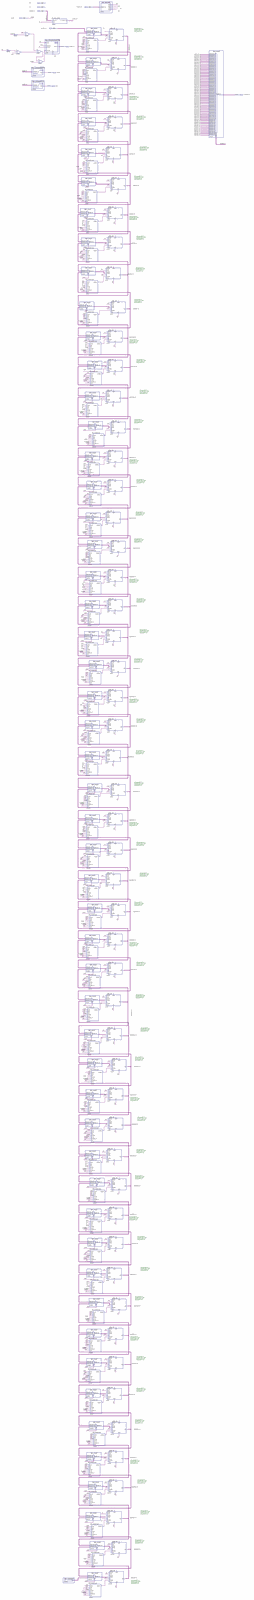
[diagram p0: schematic sheet, whole]
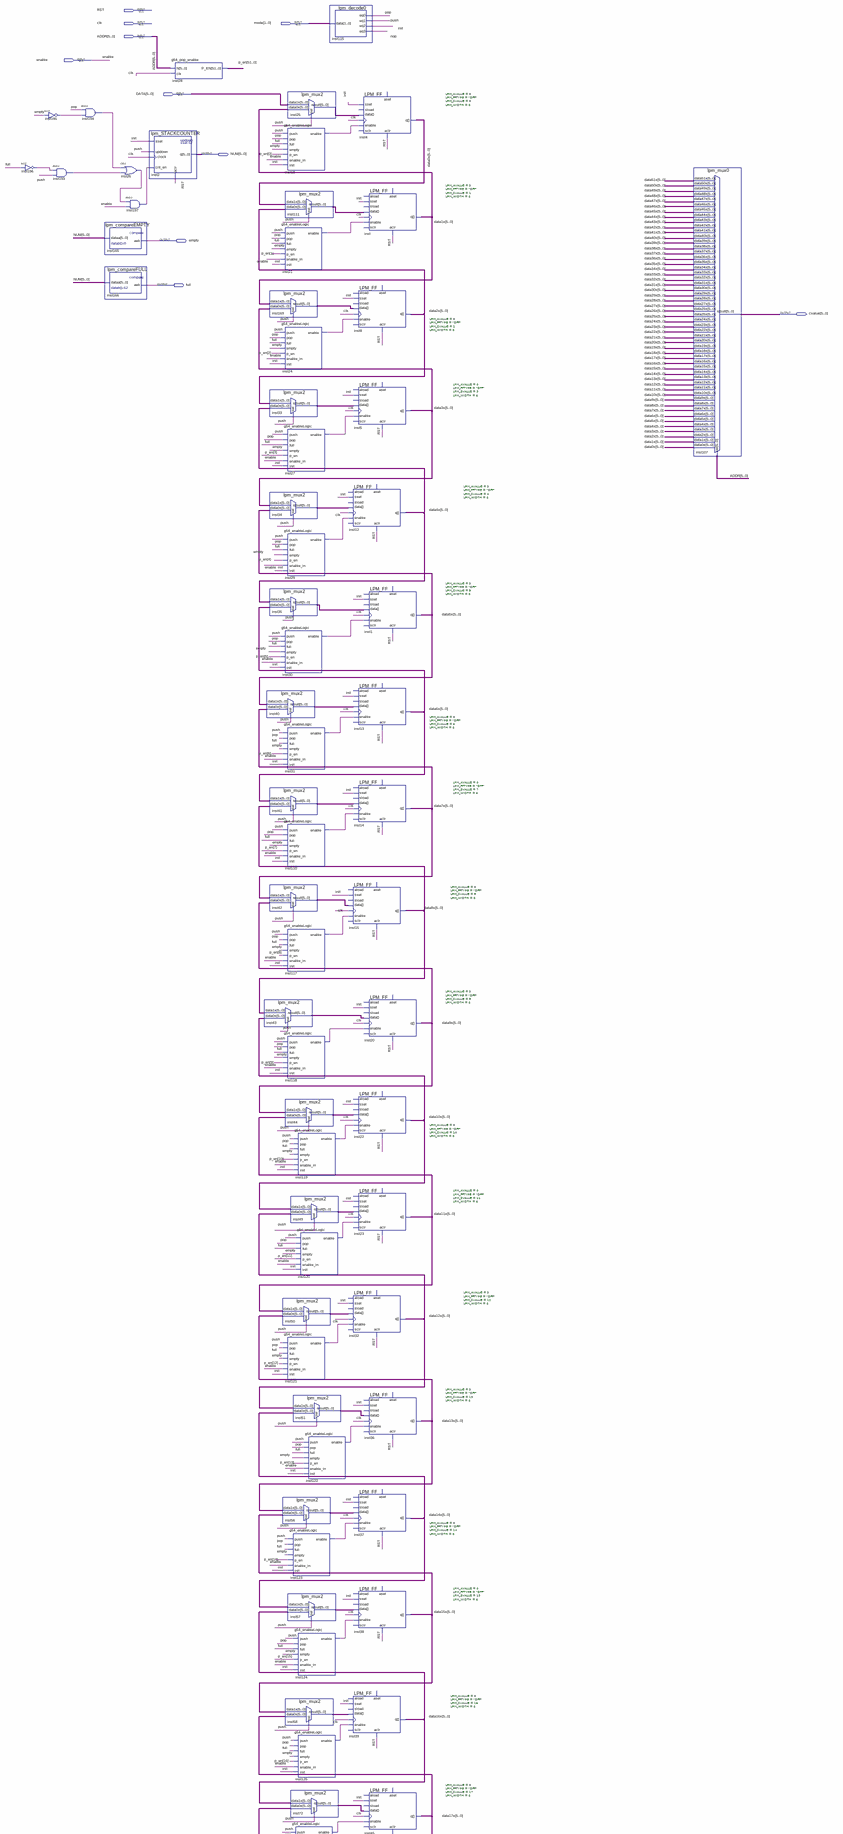
[diagram p1: schematic sheet, upper part]
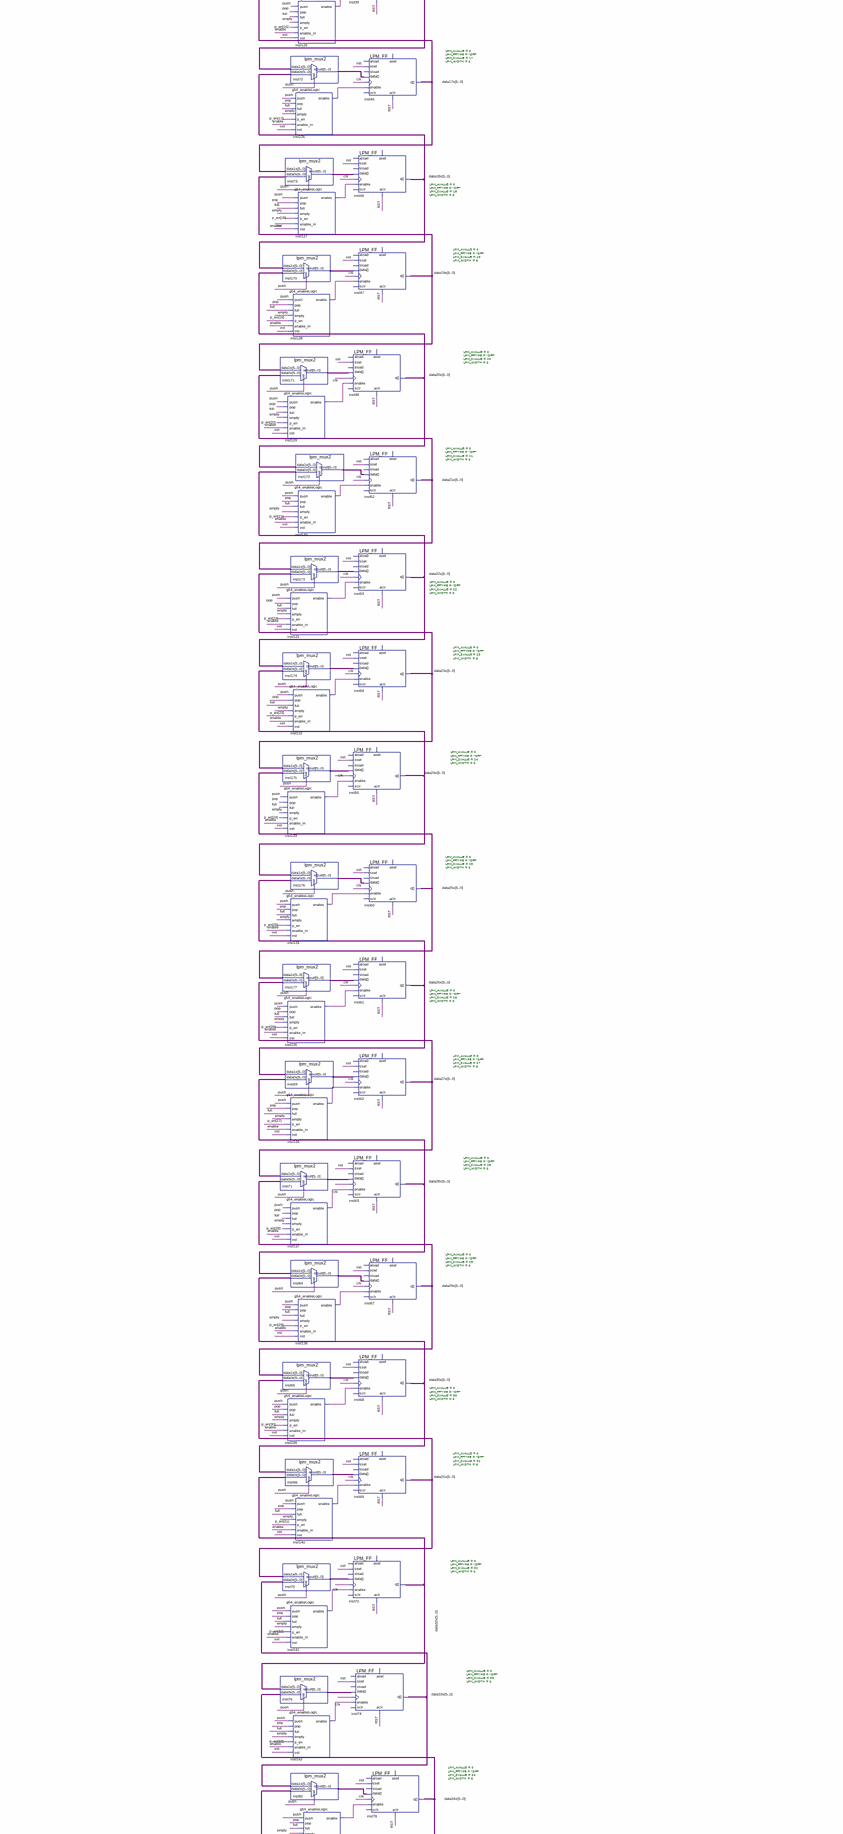
[diagram p2: schematic sheet, middle part]
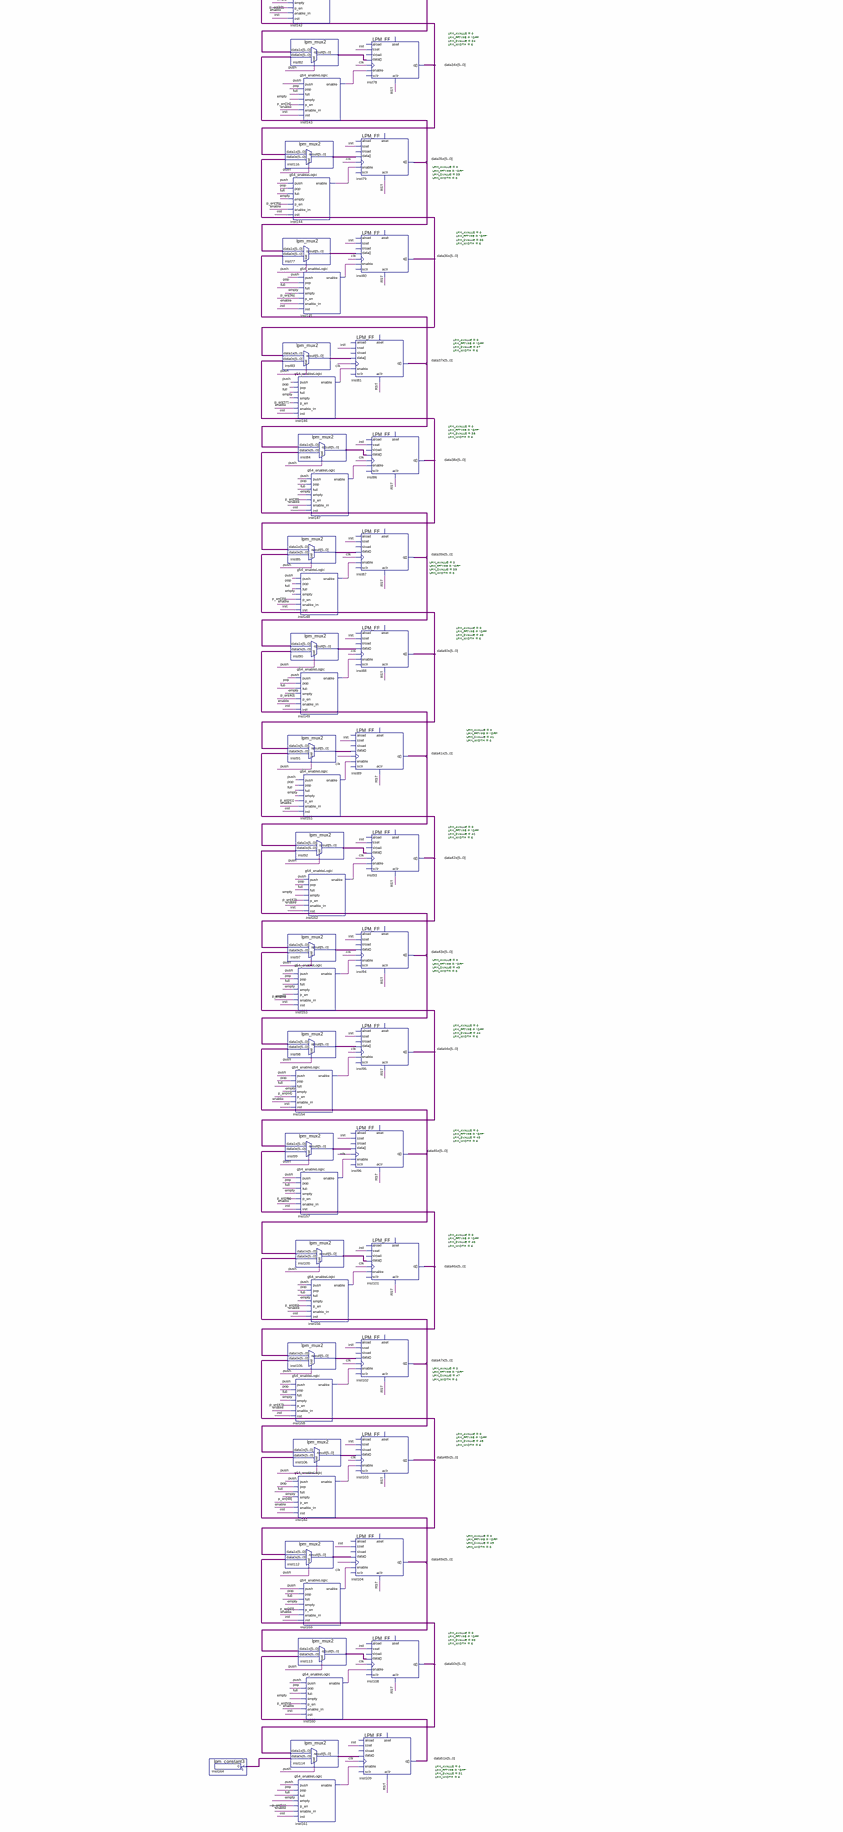
[diagram p3: schematic sheet, lower part]
// Quartus schematic g54_stack52.bdf as structural Verilog: 169 symbols, 10 pins
module g54_stack52 (
  input  RST,
  input  clk,
  input  [1:0] mode,
  input  [5:0] ADDR,
  input  enable,
  input  [5:0] DATA,
  output [5:0] NUM,
  output empty,
  output full,
  output [5:0] cvalue
);

  wire init, inst18_enable, inst21_enable, inst24_enable, inst26_out, inst27_enable, inst29_enable,
       inst30_enable, inst31_enable, inst110_enable, inst117_enable, inst118_enable, inst119_enable,
       inst120_enable, inst121_enable, inst122_enable, inst123_enable, inst124_enable, inst125_enable,
       inst126_enable, inst127_enable, inst128_enable, inst129_enable, inst130_enable, inst131_enable,
       inst132_enable, inst133_enable, inst134_enable, inst135_enable, inst136_enable, inst137_enable,
       inst138_enable, inst139_enable, inst140_enable, inst141_enable, inst142_enable, inst143_enable,
       inst144_enable, inst145_enable, inst146_enable, inst147_enable, inst148_enable, inst149_enable,
       inst151_enable, inst152_enable, inst153_enable, inst154_enable, inst156_enable, inst157_enable,
       inst158_enable, inst159_enable, inst160_enable, inst161_enable, inst162_enable, inst193_out,
       inst194_out, inst195_out, inst196_out, inst197_out, nop, pop, push;
  wire [5:0] data0x, data1x, data2x, data3x, data4x, data5x, data6x, data7x, data8x, data9x, data10x,
       data11x, data12x, data13x, data14x, data15x, data16x, data17x, data18x, data19x, data20x, data21x,
       data22x, data23x, data24x, data25x, data26x, data27x, data28x, data29x, data30x, data31x, data32x,
       data33x, data34x, data35x, data36x, data37x, data38x, data39x, data40x, data41x, data42x, data43x,
       data44x, data45x, data46x, data47x, data48x, data49x, data50x, data51x, inst25_result, inst33_result,
       inst34_result, inst35_result, inst40_result, inst41_result, inst42_result, inst43_result,
       inst44_result, inst49_result, inst50_result, inst51_result, inst56_result, inst57_result,
       inst58_result, inst59_result, inst64_result, inst65_result, inst66_result, inst71_result,
       inst72_result, inst73_result, inst75_result, inst76_result, inst77_result, inst82_result,
       inst83_result, inst84_result, inst85_result, inst90_result, inst91_result, inst92_result,
       inst97_result, inst98_result, inst99_result, inst100_result, inst105_result, inst106_result,
       inst111_result, inst112_result, inst113_result, inst114_result, inst116_result, inst164_result,
       inst169_result, inst170_result, inst171_result, inst172_result, inst173_result, inst174_result,
       inst175_result, inst176_result, inst177_result;
  wire [51:0] p_en;

  not inst196 (inst196_out, full);
  not inst195 (inst195_out, empty);
  and inst193 (inst193_out, inst196_out, push);
  and inst194 (inst194_out, pop, inst195_out);
  lpm_compareEMPTY inst165 (.dataa(NUM), .aeb(empty));
  lpm_compareFULL inst166 (.dataa(NUM), .aeb(full));
  or inst26 (inst26_out, inst194_out, inst193_out);
  and inst197 (inst197_out, inst26_out, enable);
  lpm_STACKCOUNTER inst2 (.sset(init), .updown(push), .clock(clk), .cnt_en(inst197_out), .aclr(RST), .q(NUM));
  g54_pop_enable inst28 (.N(ADDR), .clk(clk), .P_EN(p_en));
  lpm_constant3 inst164 (.result(inst164_result));
  g54_enableLogic inst21 (
    .push(push), .pop(pop), .full(full), .empty(empty), .p_en(p_en[1]), .enable_in(enable), .init(init),
    .enable(inst21_enable));
  lpm_mux2 inst169 (.data1x(data1x), .data0x(data3x), .sel(push), .result(inst169_result));
  g54_enableLogic inst24 (
    .push(push), .pop(pop), .full(full), .empty(empty), .p_en(p_en[2]), .enable_in(enable), .init(init),
    .enable(inst24_enable));
  lpm_mux2 inst33 (.data1x(data2x), .data0x(data4x), .sel(push), .result(inst33_result));
  lpm_mux2 inst34 (.data1x(data3x), .data0x(data5x), .sel(push), .result(inst34_result));
  lpm_mux2 inst35 (.data1x(data4x), .data0x(data6x), .sel(push), .result(inst35_result));
  g54_enableLogic inst30 (
    .push(push), .pop(pop), .full(full), .empty(empty), .p_en(p_en[5]), .enable_in(enable), .init(init),
    .enable(inst30_enable));
  lpm_mux2 inst40 (.data1x(data5x), .data0x(data7x), .sel(push), .result(inst40_result));
  lpm_mux2 inst41 (.data1x(data6x), .data0x(data8x), .sel(push), .result(inst41_result));
  lpm_mux2 inst42 (.data1x(data7x), .data0x(data9x), .sel(push), .result(inst42_result));
  lpm_mux2 inst43 (.data1x(data8x), .data0x(data10x), .sel(push), .result(inst43_result));
  lpm_mux2 inst171 (.data1x(data19x), .data0x(data21x), .sel(push), .result(inst171_result));
  lpm_mux2 inst71 (.data1x(data27x), .data0x(data29x), .sel(push), .result(inst71_result));
  lpm_mux2 inst76 (.data1x(data32x), .data0x(data34x), .sel(push), .result(inst76_result));
  lpm_mux2 inst25 (.data1x(DATA), .data0x(data1x), .sel(push), .result(inst25_result));
  g54_enableLogic inst18 (
    .push(push), .pop(pop), .full(full), .empty(empty), .p_en(p_en[0]), .enable_in(enable), .init(init),
    .enable(inst18_enable));
  lpm_mux2 inst111 (.data1x(data0x), .data0x(data2x), .sel(push), .result(inst111_result));
  g54_enableLogic inst27 (
    .push(push), .pop(pop), .full(full), .empty(empty), .p_en(p_en[3]), .enable_in(enable), .init(init),
    .enable(inst27_enable));
  g54_enableLogic inst29 (
    .push(push), .pop(pop), .full(full), .empty(empty), .p_en(p_en[4]), .enable_in(enable), .init(init),
    .enable(inst29_enable));
  g54_enableLogic inst31 (
    .push(push), .pop(pop), .full(full), .empty(empty), .p_en(p_en[6]), .enable_in(enable), .init(init),
    .enable(inst31_enable));
  g54_enableLogic inst110 (
    .push(push), .pop(pop), .full(full), .empty(empty), .p_en(p_en[7]), .enable_in(enable), .init(init),
    .enable(inst110_enable));
  g54_enableLogic inst117 (
    .push(push), .pop(pop), .full(full), .empty(empty), .p_en(p_en[8]), .enable_in(enable), .init(init),
    .enable(inst117_enable));
  g54_enableLogic inst118 (
    .push(push), .pop(pop), .full(full), .empty(empty), .p_en(p_en[9]), .enable_in(enable), .init(init),
    .enable(inst118_enable));
  lpm_mux2 inst44 (.data1x(data9x), .data0x(data11x), .sel(push), .result(inst44_result));
  g54_enableLogic inst119 (
    .push(push), .pop(pop), .full(full), .empty(empty), .p_en(p_en[10]), .enable_in(enable), .init(init),
    .enable(inst119_enable));
  lpm_mux2 inst49 (.data1x(data10x), .data0x(data12x), .sel(push), .result(inst49_result));
  g54_enableLogic inst120 (
    .push(push), .pop(pop), .full(full), .empty(empty), .p_en(p_en[11]), .enable_in(enable), .init(init),
    .enable(inst120_enable));
  lpm_mux2 inst50 (.data1x(data11x), .data0x(data13x), .sel(push), .result(inst50_result));
  g54_enableLogic inst121 (
    .push(push), .pop(pop), .full(full), .empty(empty), .p_en(p_en[12]), .enable_in(enable), .init(init),
    .enable(inst121_enable));
  lpm_mux2 inst51 (.data1x(data12x), .data0x(data14x), .sel(push), .result(inst51_result));
  lpm_mux2 inst56 (.data1x(data13x), .data0x(data15x), .sel(push), .result(inst56_result));
  g54_enableLogic inst123 (
    .push(push), .pop(pop), .full(full), .empty(empty), .p_en(p_en[14]), .enable_in(enable), .init(init),
    .enable(inst123_enable));
  lpm_mux2 inst57 (.data1x(data14x), .data0x(data16x), .sel(push), .result(inst57_result));
  g54_enableLogic inst124 (
    .push(push), .pop(pop), .full(full), .empty(empty), .p_en(p_en[15]), .enable_in(enable), .init(init),
    .enable(inst124_enable));
  lpm_mux2 inst58 (.data1x(data15x), .data0x(data17x), .sel(push), .result(inst58_result));
  g54_enableLogic inst125 (
    .push(push), .pop(pop), .full(full), .empty(empty), .p_en(p_en[16]), .enable_in(enable), .init(init),
    .enable(inst125_enable));
  lpm_mux2 inst72 (.data1x(data16x), .data0x(data18x), .sel(push), .result(inst72_result));
  g54_enableLogic inst126 (
    .push(push), .pop(pop), .full(full), .empty(empty), .p_en(p_en[17]), .enable_in(enable), .init(init),
    .enable(inst126_enable));
  lpm_mux2 inst73 (.data1x(data17x), .data0x(data19x), .sel(push), .result(inst73_result));
  g54_enableLogic inst127 (
    .push(push), .pop(pop), .full(full), .empty(empty), .p_en(p_en[18]), .enable_in(enable), .init(init),
    .enable(inst127_enable));
  lpm_mux2 inst170 (.data1x(data18x), .data0x(data20x), .sel(push), .result(inst170_result));
  g54_enableLogic inst128 (
    .push(push), .pop(pop), .full(full), .empty(empty), .p_en(p_en[19]), .enable_in(enable), .init(init),
    .enable(inst128_enable));
  g54_enableLogic inst129 (
    .push(push), .pop(pop), .full(full), .empty(empty), .p_en(p_en[20]), .enable_in(enable), .init(init),
    .enable(inst129_enable));
  lpm_mux2 inst172 (.data1x(data20x), .data0x(data22x), .sel(push), .result(inst172_result));
  g54_enableLogic inst130 (
    .push(push), .pop(pop), .full(full), .empty(empty), .p_en(p_en[21]), .enable_in(enable), .init(init),
    .enable(inst130_enable));
  lpm_mux2 inst173 (.data1x(data21x), .data0x(data23x), .sel(push), .result(inst173_result));
  g54_enableLogic inst131 (
    .push(push), .pop(pop), .full(full), .empty(empty), .p_en(p_en[22]), .enable_in(enable), .init(init),
    .enable(inst131_enable));
  lpm_mux2 inst174 (.data1x(data22x), .data0x(data24x), .sel(push), .result(inst174_result));
  g54_enableLogic inst132 (
    .push(push), .pop(pop), .full(full), .empty(empty), .p_en(p_en[23]), .enable_in(enable), .init(init),
    .enable(inst132_enable));
  lpm_mux2 inst175 (.data1x(data23x), .data0x(data25x), .sel(push), .result(inst175_result));
  g54_enableLogic inst133 (
    .push(push), .pop(pop), .full(full), .empty(empty), .p_en(p_en[24]), .enable_in(enable), .init(init),
    .enable(inst133_enable));
  lpm_mux2 inst176 (.data1x(data24x), .data0x(data26x), .sel(push), .result(inst176_result));
  g54_enableLogic inst134 (
    .push(push), .pop(pop), .full(full), .empty(empty), .p_en(p_en[25]), .enable_in(enable), .init(init),
    .enable(inst134_enable));
  lpm_mux2 inst177 (.data1x(data25x), .data0x(data27x), .sel(push), .result(inst177_result));
  g54_enableLogic inst135 (
    .push(push), .pop(pop), .full(full), .empty(empty), .p_en(p_en[26]), .enable_in(enable), .init(init),
    .enable(inst135_enable));
  lpm_mux2 inst59 (.data1x(data26x), .data0x(data28x), .sel(push), .result(inst59_result));
  g54_enableLogic inst136 (
    .push(push), .pop(pop), .full(full), .empty(empty), .p_en(p_en[27]), .enable_in(enable), .init(init),
    .enable(inst136_enable));
  g54_enableLogic inst137 (
    .push(push), .pop(pop), .full(full), .empty(empty), .p_en(p_en[28]), .enable_in(enable), .init(init),
    .enable(inst137_enable));
  lpm_mux2 inst64 (.data1x(data28x), .data0x(data30x), .sel(push), .result(inst64_result));
  g54_enableLogic inst138 (
    .push(push), .pop(pop), .full(full), .empty(empty), .p_en(p_en[29]), .enable_in(enable), .init(init),
    .enable(inst138_enable));
  lpm_mux2 inst65 (.data1x(data29x), .data0x(data31x), .sel(push), .result(inst65_result));
  g54_enableLogic inst139 (
    .push(push), .pop(pop), .full(full), .empty(empty), .p_en(p_en[30]), .enable_in(enable), .init(init),
    .enable(inst139_enable));
  lpm_mux2 inst66 (.data1x(data30x), .data0x(data32x), .sel(push), .result(inst66_result));
  g54_enableLogic inst140 (
    .push(push), .pop(pop), .full(full), .empty(empty), .p_en(p_en[31]), .enable_in(enable), .init(init),
    .enable(inst140_enable));
  lpm_mux2 inst75 (.data1x(data31x), .data0x(data33x), .sel(push), .result(inst75_result));
  g54_enableLogic inst141 (
    .push(push), .pop(pop), .full(full), .empty(empty), .p_en(p_en[32]), .enable_in(enable), .init(init),
    .enable(inst141_enable));
  g54_enableLogic inst142 (
    .push(push), .pop(pop), .full(full), .empty(empty), .p_en(p_en[33]), .enable_in(enable), .init(init),
    .enable(inst142_enable));
  lpm_mux2 inst82 (.data1x(data33x), .data0x(data35x), .sel(push), .result(inst82_result));
  g54_enableLogic inst143 (
    .push(push), .pop(pop), .full(full), .empty(empty), .p_en(p_en[34]), .enable_in(enable), .init(init),
    .enable(inst143_enable));
  lpm_mux2 inst116 (.data1x(data34x), .data0x(data36x), .sel(push), .result(inst116_result));
  g54_enableLogic inst144 (
    .push(push), .pop(pop), .full(full), .empty(empty), .p_en(p_en[35]), .enable_in(enable), .init(init),
    .enable(inst144_enable));
  lpm_mux2 inst77 (.data1x(data35x), .data0x(data37x), .sel(push), .result(inst77_result));
  g54_enableLogic inst145 (
    .push(push), .pop(pop), .full(full), .empty(empty), .p_en(p_en[36]), .enable_in(enable), .init(init),
    .enable(inst145_enable));
  lpm_mux2 inst83 (.data1x(data36x), .data0x(data38x), .sel(push), .result(inst83_result));
  g54_enableLogic inst146 (
    .push(push), .pop(pop), .full(full), .empty(empty), .p_en(p_en[37]), .enable_in(enable), .init(init),
    .enable(inst146_enable));
  lpm_mux2 inst84 (.data1x(data37x), .data0x(data39x), .sel(push), .result(inst84_result));
  lpm_mux2 inst85 (.data1x(data38x), .data0x(data40x), .sel(push), .result(inst85_result));
  g54_enableLogic inst148 (
    .push(push), .pop(pop), .full(full), .empty(empty), .p_en(p_en[39]), .enable_in(enable), .init(init),
    .enable(inst148_enable));
  lpm_mux2 inst90 (.data1x(data39x), .data0x(data41x), .sel(push), .result(inst90_result));
  g54_enableLogic inst149 (
    .push(push), .pop(pop), .full(full), .empty(empty), .p_en(p_en[40]), .enable_in(enable), .init(init),
    .enable(inst149_enable));
  lpm_mux2 inst91 (.data1x(data40x), .data0x(data42x), .sel(push), .result(inst91_result));
  g54_enableLogic inst151 (
    .push(push), .pop(pop), .full(full), .empty(empty), .p_en(p_en[41]), .enable_in(enable), .init(init),
    .enable(inst151_enable));
  lpm_mux2 inst92 (.data1x(data41x), .data0x(data43x), .sel(push), .result(inst92_result));
  lpm_mux2 inst97 (.data1x(data42x), .data0x(data44x), .sel(push), .result(inst97_result));
  g54_enableLogic inst153 (
    .push(push), .pop(pop), .full(full), .empty(empty), .p_en(p_en[43]), .enable_in(enable), .init(init),
    .enable(inst153_enable));
  lpm_mux2 inst98 (.data1x(data43x), .data0x(data45x), .sel(push), .result(inst98_result));
  g54_enableLogic inst154 (
    .push(push), .pop(pop), .full(full), .empty(empty), .p_en(p_en[44]), .enable_in(enable), .init(init),
    .enable(inst154_enable));
  lpm_mux2 inst99 (.data1x(data44x), .data0x(data46x), .sel(push), .result(inst99_result));
  g54_enableLogic inst157 (
    .push(push), .pop(pop), .full(full), .empty(empty), .p_en(p_en[45]), .enable_in(enable), .init(init),
    .enable(inst157_enable));
  lpm_mux2 inst100 (.data1x(data45x), .data0x(data47x), .sel(push), .result(inst100_result));
  lpm_mux2 inst105 (.data1x(data46x), .data0x(data48x), .sel(push), .result(inst105_result));
  g54_enableLogic inst158 (
    .push(push), .pop(pop), .full(full), .empty(empty), .p_en(p_en[47]), .enable_in(enable), .init(init),
    .enable(inst158_enable));
  lpm_mux2 inst106 (.data1x(data47x), .data0x(data49x), .sel(push), .result(inst106_result));
  g54_enableLogic inst162 (
    .push(push), .pop(pop), .full(full), .empty(empty), .p_en(p_en[48]), .enable_in(enable), .init(init),
    .enable(inst162_enable));
  lpm_mux2 inst112 (.data1x(data48x), .data0x(data50x), .sel(push), .result(inst112_result));
  g54_enableLogic inst159 (
    .push(push), .pop(pop), .full(full), .empty(empty), .p_en(p_en[49]), .enable_in(enable), .init(init),
    .enable(inst159_enable));
  lpm_mux2 inst113 (.data1x(data49x), .data0x(data51x), .sel(push), .result(inst113_result));
  g54_enableLogic inst160 (
    .push(push), .pop(pop), .full(full), .empty(empty), .p_en(p_en[50]), .enable_in(enable), .init(init),
    .enable(inst160_enable));
  lpm_mux2 inst114 (.data1x(data50x), .data0x(inst164_result), .sel(push), .result(inst114_result));
  g54_enableLogic inst161 (
    .push(push), .pop(pop), .full(full), .empty(empty), .p_en(p_en[51]), .enable_in(enable), .init(init),
    .enable(inst161_enable));
  g54_enableLogic inst122 (
    .push(push), .pop(pop), .full(full), .empty(empty), .p_en(p_en[13]), .enable_in(enable), .init(init),
    .enable(inst122_enable));
  g54_enableLogic inst147 (
    .push(push), .pop(pop), .full(full), .empty(empty), .p_en(p_en[38]), .enable_in(enable), .init(init),
    .enable(inst147_enable));
  g54_enableLogic inst152 (
    .push(push), .pop(pop), .full(full), .empty(empty), .p_en(p_en[42]), .enable_in(enable), .init(init),
    .enable(inst152_enable));
  g54_enableLogic inst156 (
    .push(push), .pop(pop), .full(full), .empty(empty), .p_en(p_en[46]), .enable_in(enable), .init(init),
    .enable(inst156_enable));
  lpm_decode0 inst115 (.data(mode), .eq0(pop), .eq1(push), .eq2(init), .eq3(nop));
  LPM_FF #(.LPM_AVALUE(0), .LPM_FFTYPE("DFF"), .LPM_SVALUE(0), .LPM_WIDTH(6)) inst4 (
    .aclr(RST), .clock(clk), .data(inst25_result), .enable(inst18_enable), .sset(init), .q(data0x));  // open: aset, sclr, sload
  LPM_FF #(.LPM_AVALUE(0), .LPM_FFTYPE("DFF"), .LPM_SVALUE(1), .LPM_WIDTH(6)) inst (
    .enable(inst21_enable), .clock(clk), .sset(init), .aclr(RST), .data(inst111_result), .q(data1x));  // open: aload, sload, aset, sclr
  LPM_FF #(.LPM_AVALUE(0), .LPM_FFTYPE("DFF"), .LPM_SVALUE(2), .LPM_WIDTH(6)) inst8 (
    .enable(inst24_enable), .clock(clk), .sset(init), .aclr(RST), .data(inst169_result), .q(data2x));  // open: aload, sload, aset, sclr
  LPM_FF #(.LPM_AVALUE(0), .LPM_FFTYPE("DFF"), .LPM_SVALUE(3), .LPM_WIDTH(6)) inst5 (
    .enable(inst27_enable), .clock(clk), .sset(init), .aclr(RST), .data(inst33_result), .q(data3x));  // open: aload, sload, aset, sclr
  LPM_FF #(.LPM_AVALUE(0), .LPM_FFTYPE("DFF"), .LPM_SVALUE(4), .LPM_WIDTH(6)) inst12 (
    .enable(inst29_enable), .clock(clk), .sset(init), .aclr(RST), .data(inst34_result), .q(data4x));  // open: aload, sload, aset, sclr
  LPM_FF #(.LPM_AVALUE(0), .LPM_FFTYPE("DFF"), .LPM_SVALUE(5), .LPM_WIDTH(6)) inst1 (
    .enable(inst30_enable), .clock(clk), .sset(init), .aclr(RST), .data(inst35_result), .q(data5x));  // open: aload, sload, aset, sclr
  LPM_FF #(.LPM_AVALUE(0), .LPM_FFTYPE("DFF"), .LPM_SVALUE(6), .LPM_WIDTH(6)) inst13 (
    .enable(inst31_enable), .clock(clk), .sset(init), .aclr(RST), .data(inst40_result), .q(data6x));  // open: aload, sload, aset, sclr
  LPM_FF #(.LPM_AVALUE(0), .LPM_FFTYPE("DFF"), .LPM_SVALUE(7), .LPM_WIDTH(6)) inst14 (
    .enable(inst110_enable), .clock(clk), .sset(init), .aclr(RST), .data(inst41_result), .q(data7x));  // open: aload, sload, aset, sclr
  LPM_FF #(.LPM_AVALUE(0), .LPM_FFTYPE("DFF"), .LPM_SVALUE(8), .LPM_WIDTH(6)) inst15 (
    .enable(inst117_enable), .clock(clk), .sset(init), .aclr(RST), .data(inst42_result), .q(data8x));  // open: aload, sload, aset, sclr
  LPM_FF #(.LPM_AVALUE(0), .LPM_FFTYPE("DFF"), .LPM_SVALUE(9), .LPM_WIDTH(6)) inst20 (
    .enable(inst118_enable), .clock(clk), .sset(init), .aclr(RST), .data(inst43_result), .q(data9x));  // open: aload, sload, aset, sclr
  LPM_FF #(.LPM_AVALUE(0), .LPM_FFTYPE("DFF"), .LPM_SVALUE(10), .LPM_WIDTH(6)) inst22 (
    .enable(inst119_enable), .clock(clk), .sset(init), .aclr(RST), .data(inst44_result), .q(data10x));  // open: aload, sload, aset, sclr
  LPM_FF #(.LPM_AVALUE(0), .LPM_FFTYPE("DFF"), .LPM_SVALUE(11), .LPM_WIDTH(6)) inst23 (
    .enable(inst120_enable), .clock(clk), .sset(init), .aclr(RST), .data(inst49_result), .q(data11x));  // open: aload, sload, aset, sclr
  LPM_FF #(.LPM_AVALUE(0), .LPM_FFTYPE("DFF"), .LPM_SVALUE(12), .LPM_WIDTH(6)) inst32 (
    .enable(inst121_enable), .clock(clk), .sset(init), .aclr(RST), .data(inst50_result), .q(data12x));  // open: aload, sload, aset, sclr
  LPM_FF #(.LPM_AVALUE(0), .LPM_FFTYPE("DFF"), .LPM_SVALUE(13), .LPM_WIDTH(6)) inst36 (
    .enable(inst122_enable), .clock(clk), .sset(init), .aclr(RST), .data(inst51_result), .q(data13x));  // open: aload, sload, aset, sclr
  LPM_FF #(.LPM_AVALUE(0), .LPM_FFTYPE("DFF"), .LPM_SVALUE(14), .LPM_WIDTH(6)) inst37 (
    .enable(inst123_enable), .clock(clk), .sset(init), .aclr(RST), .data(inst56_result), .q(data14x));  // open: aload, sload, aset, sclr
  LPM_FF #(.LPM_AVALUE(0), .LPM_FFTYPE("DFF"), .LPM_SVALUE(15), .LPM_WIDTH(6)) inst38 (
    .enable(inst124_enable), .clock(clk), .sset(init), .aclr(RST), .data(inst57_result), .q(data15x));  // open: aload, sload, aset, sclr
  LPM_FF #(.LPM_AVALUE(0), .LPM_FFTYPE("DFF"), .LPM_SVALUE(16), .LPM_WIDTH(6)) inst39 (
    .enable(inst125_enable), .clock(clk), .sset(init), .aclr(RST), .data(inst58_result), .q(data16x));  // open: aload, sload, aset, sclr
  LPM_FF #(.LPM_AVALUE(0), .LPM_FFTYPE("DFF"), .LPM_SVALUE(17), .LPM_WIDTH(6)) inst45 (
    .enable(inst126_enable), .clock(clk), .sset(init), .aclr(RST), .data(inst72_result), .q(data17x));  // open: aload, sload, aset, sclr
  LPM_FF #(.LPM_AVALUE(0), .LPM_FFTYPE("DFF"), .LPM_SVALUE(18), .LPM_WIDTH(6)) inst46 (
    .enable(inst127_enable), .clock(clk), .sset(init), .aclr(RST), .data(inst73_result), .q(data18x));  // open: aload, sload, aset, sclr
  LPM_FF #(.LPM_AVALUE(0), .LPM_FFTYPE("DFF"), .LPM_SVALUE(19), .LPM_WIDTH(6)) inst47 (
    .enable(inst128_enable), .clock(clk), .sset(init), .aclr(RST), .data(inst170_result), .q(data19x));  // open: aload, sload, aset, sclr
  LPM_FF #(.LPM_AVALUE(0), .LPM_FFTYPE("DFF"), .LPM_SVALUE(20), .LPM_WIDTH(6)) inst48 (
    .enable(inst129_enable), .clock(clk), .sset(init), .aclr(RST), .data(inst171_result), .q(data20x));  // open: aload, sload, aset, sclr
  LPM_FF #(.LPM_AVALUE(0), .LPM_FFTYPE("DFF"), .LPM_SVALUE(21), .LPM_WIDTH(6)) inst52 (
    .enable(inst130_enable), .clock(clk), .sset(init), .aclr(RST), .data(inst172_result), .q(data21x));  // open: aload, sload, aset, sclr
  LPM_FF #(.LPM_AVALUE(0), .LPM_FFTYPE("DFF"), .LPM_SVALUE(22), .LPM_WIDTH(6)) inst53 (
    .enable(inst131_enable), .clock(clk), .sset(init), .aclr(RST), .data(inst173_result), .q(data22x));  // open: aload, sload, aset, sclr
  LPM_FF #(.LPM_AVALUE(0), .LPM_FFTYPE("DFF"), .LPM_SVALUE(23), .LPM_WIDTH(6)) inst54 (
    .enable(inst132_enable), .clock(clk), .sset(init), .aclr(RST), .data(inst174_result), .q(data23x));  // open: aload, sload, aset, sclr
  LPM_FF #(.LPM_AVALUE(0), .LPM_FFTYPE("DFF"), .LPM_SVALUE(24), .LPM_WIDTH(6)) inst55 (
    .enable(inst133_enable), .clock(clk), .sset(init), .aclr(RST), .data(inst175_result), .q(data24x));  // open: aload, sload, aset, sclr
  LPM_FF #(.LPM_AVALUE(0), .LPM_FFTYPE("DFF"), .LPM_SVALUE(25), .LPM_WIDTH(6)) inst60 (
    .enable(inst134_enable), .clock(clk), .sset(init), .aclr(RST), .data(inst176_result), .q(data25x));  // open: aload, sload, aset, sclr
  LPM_FF #(.LPM_AVALUE(0), .LPM_FFTYPE("DFF"), .LPM_SVALUE(26), .LPM_WIDTH(6)) inst61 (
    .enable(inst135_enable), .clock(clk), .sset(init), .aclr(RST), .data(inst177_result), .q(data26x));  // open: aload, sload, aset, sclr
  LPM_FF #(.LPM_AVALUE(0), .LPM_FFTYPE("DFF"), .LPM_SVALUE(27), .LPM_WIDTH(6)) inst62 (
    .enable(inst136_enable), .clock(clk), .sset(init), .aclr(RST), .data(inst59_result), .q(data27x));  // open: aload, sload, aset, sclr
  LPM_FF #(.LPM_AVALUE(0), .LPM_FFTYPE("DFF"), .LPM_SVALUE(28), .LPM_WIDTH(6)) inst63 (
    .enable(inst137_enable), .clock(clk), .sset(init), .aclr(RST), .data(inst71_result), .q(data28x));  // open: aload, sload, aset, sclr
  LPM_FF #(.LPM_AVALUE(0), .LPM_FFTYPE("DFF"), .LPM_SVALUE(29), .LPM_WIDTH(6)) inst67 (
    .enable(inst138_enable), .clock(clk), .sset(init), .aclr(RST), .data(inst64_result), .q(data29x));  // open: aload, sload, aset, sclr
  LPM_FF #(.LPM_AVALUE(0), .LPM_FFTYPE("DFF"), .LPM_SVALUE(30), .LPM_WIDTH(6)) inst68 (
    .enable(inst139_enable), .clock(clk), .sset(init), .aclr(RST), .data(inst65_result), .q(data30x));  // open: aload, sload, aset, sclr
  LPM_FF #(.LPM_AVALUE(0), .LPM_FFTYPE("DFF"), .LPM_SVALUE(31), .LPM_WIDTH(6)) inst69 (
    .enable(inst140_enable), .clock(clk), .sset(init), .aclr(RST), .data(inst66_result), .q(data31x));  // open: aload, sload, aset, sclr
  LPM_FF #(.LPM_AVALUE(0), .LPM_FFTYPE("DFF"), .LPM_SVALUE(32), .LPM_WIDTH(6)) inst70 (
    .enable(inst141_enable), .clock(clk), .sset(init), .aclr(RST), .data(inst75_result), .q(data32x));  // open: aload, sload, aset, sclr
  LPM_FF #(.LPM_AVALUE(0), .LPM_FFTYPE("DFF"), .LPM_SVALUE(33), .LPM_WIDTH(6)) inst74 (
    .enable(inst142_enable), .clock(clk), .sset(init), .aclr(RST), .data(inst76_result), .q(data33x));  // open: aload, sload, aset, sclr
  LPM_FF #(.LPM_AVALUE(0), .LPM_FFTYPE("DFF"), .LPM_SVALUE(35), .LPM_WIDTH(6)) inst79 (
    .enable(inst144_enable), .clock(clk), .sset(init), .aclr(RST), .data(inst116_result), .q(data35x));  // open: aload, sload, aset, sclr
  LPM_FF #(.LPM_AVALUE(0), .LPM_FFTYPE("DFF"), .LPM_SVALUE(36), .LPM_WIDTH(6)) inst80 (
    .enable(inst145_enable), .clock(clk), .sset(init), .aclr(RST), .data(inst77_result), .q(data36x));  // open: aload, sload, aset, sclr
  LPM_FF #(.LPM_AVALUE(0), .LPM_FFTYPE("DFF"), .LPM_SVALUE(37), .LPM_WIDTH(6)) inst81 (
    .enable(inst146_enable), .clock(clk), .sset(init), .aclr(RST), .data(inst83_result), .q(data37x));  // open: aload, sload, aset, sclr
  LPM_FF #(.LPM_AVALUE(0), .LPM_FFTYPE("DFF"), .LPM_SVALUE(39), .LPM_WIDTH(6)) inst87 (
    .enable(inst148_enable), .clock(clk), .sset(init), .aclr(RST), .data(inst85_result), .q(data39x));  // open: aload, sload, aset, sclr
  LPM_FF #(.LPM_AVALUE(0), .LPM_FFTYPE("DFF"), .LPM_SVALUE(40), .LPM_WIDTH(6)) inst88 (
    .enable(inst149_enable), .clock(clk), .sset(init), .aclr(RST), .data(inst90_result), .q(data40x));  // open: aload, sload, aset, sclr
  LPM_FF #(.LPM_AVALUE(0), .LPM_FFTYPE("DFF"), .LPM_SVALUE(41), .LPM_WIDTH(6)) inst89 (
    .enable(inst151_enable), .clock(clk), .sset(init), .aclr(RST), .data(inst91_result), .q(data41x));  // open: aload, sload, aset, sclr
  LPM_FF #(.LPM_AVALUE(0), .LPM_FFTYPE("DFF"), .LPM_SVALUE(43), .LPM_WIDTH(6)) inst94 (
    .enable(inst153_enable), .clock(clk), .sset(init), .aclr(RST), .data(inst97_result), .q(data43x));  // open: aload, sload, aset, sclr
  LPM_FF #(.LPM_AVALUE(0), .LPM_FFTYPE("DFF"), .LPM_SVALUE(44), .LPM_WIDTH(6)) inst95 (
    .enable(inst154_enable), .clock(clk), .sset(init), .aclr(RST), .data(inst98_result), .q(data44x));  // open: aload, sload, aset, sclr
  LPM_FF #(.LPM_AVALUE(0), .LPM_FFTYPE("DFF"), .LPM_SVALUE(45), .LPM_WIDTH(6)) inst96 (
    .enable(inst157_enable), .clock(clk), .sset(init), .aclr(RST), .data(inst99_result), .q(data45x));  // open: aload, sload, aset, sclr
  LPM_FF #(.LPM_AVALUE(0), .LPM_FFTYPE("DFF"), .LPM_SVALUE(47), .LPM_WIDTH(6)) inst102 (
    .enable(inst158_enable), .clock(clk), .sset(init), .aclr(RST), .data(inst105_result), .q(data47x));  // open: aload, sload, aset, sclr
  LPM_FF #(.LPM_AVALUE(0), .LPM_FFTYPE("DFF"), .LPM_SVALUE(48), .LPM_WIDTH(6)) inst103 (
    .enable(inst162_enable), .clock(clk), .sset(init), .aclr(RST), .data(inst106_result), .q(data48x));  // open: aload, sload, aset, sclr
  LPM_FF #(.LPM_AVALUE(0), .LPM_FFTYPE("DFF"), .LPM_SVALUE(49), .LPM_WIDTH(6)) inst104 (
    .enable(inst159_enable), .clock(clk), .sset(init), .aclr(RST), .data(inst112_result), .q(data49x));  // open: aload, sload, aset, sclr
  LPM_FF #(.LPM_AVALUE(0), .LPM_FFTYPE("DFF"), .LPM_SVALUE(51), .LPM_WIDTH(6)) inst109 (
    .enable(inst161_enable), .clock(clk), .sset(init), .aclr(RST), .data(inst114_result), .q(data51x));  // open: aload, sload, aset, sclr
  LPM_FF #(.LPM_AVALUE(0), .LPM_FFTYPE("DFF"), .LPM_SVALUE(34), .LPM_WIDTH(6)) inst78 (
    .enable(inst143_enable), .clock(clk), .sset(init), .aclr(RST), .data(inst82_result), .q(data34x));  // open: aload, sload, aset, sclr
  LPM_FF #(.LPM_AVALUE(0), .LPM_FFTYPE("DFF"), .LPM_SVALUE(38), .LPM_WIDTH(6)) inst86 (
    .enable(inst147_enable), .clock(clk), .sset(init), .aclr(RST), .data(inst84_result), .q(data38x));  // open: aload, sload, aset, sclr
  LPM_FF #(.LPM_AVALUE(0), .LPM_FFTYPE("DFF"), .LPM_SVALUE(42), .LPM_WIDTH(6)) inst93 (
    .enable(inst152_enable), .clock(clk), .sset(init), .aclr(RST), .data(inst92_result), .q(data42x));  // open: aload, sload, aset, sclr
  LPM_FF #(.LPM_AVALUE(0), .LPM_FFTYPE("DFF"), .LPM_SVALUE(46), .LPM_WIDTH(6)) inst101 (
    .enable(inst156_enable), .clock(clk), .sset(init), .aclr(RST), .data(inst100_result), .q(data46x));  // open: aload, sload, aset, sclr
  LPM_FF #(.LPM_AVALUE(0), .LPM_FFTYPE("DFF"), .LPM_SVALUE(50), .LPM_WIDTH(6)) inst108 (
    .enable(inst160_enable), .clock(clk), .sset(init), .aclr(RST), .data(inst113_result), .q(data50x));  // open: aload, sload, aset, sclr
  lpm_mux0 inst107 (
    .data51x(data51x), .data50x(data50x), .data49x(data49x), .data48x(data48x), .data47x(data47x),
    .data46x(data46x), .data45x(data45x), .data44x(data44x), .data43x(data43x), .data42x(data42x),
    .data41x(data41x), .data40x(data40x), .data39x(data39x), .data38x(data38x), .data37x(data37x),
    .data36x(data36x), .data35x(data35x), .data34x(data34x), .data33x(data33x), .data32x(data32x),
    .data31x(data31x), .data30x(data30x), .data29x(data29x), .data28x(data28x), .data27x(data27x),
    .data26x(data26x), .data25x(data25x), .data24x(data24x), .data23x(data23x), .data22x(data22x),
    .data21x(data21x), .data20x(data20x), .data19x(data19x), .data18x(data18x), .data17x(data17x),
    .data16x(data16x), .data15x(data15x), .data14x(data14x), .data13x(data13x), .data12x(data12x),
    .data11x(data11x), .data10x(data10x), .data9x(data9x), .data8x(data8x), .data7x(data7x), .data6x(data6x),
    .data5x(data5x), .data4x(data4x), .data3x(data3x), .data2x(data2x), .data1x(data1x), .data0x(data0x),
    .sel(ADDR), .result(cvalue));
endmodule
